# Altium schematic sheet [04]STORAGE.SchDoc
size B
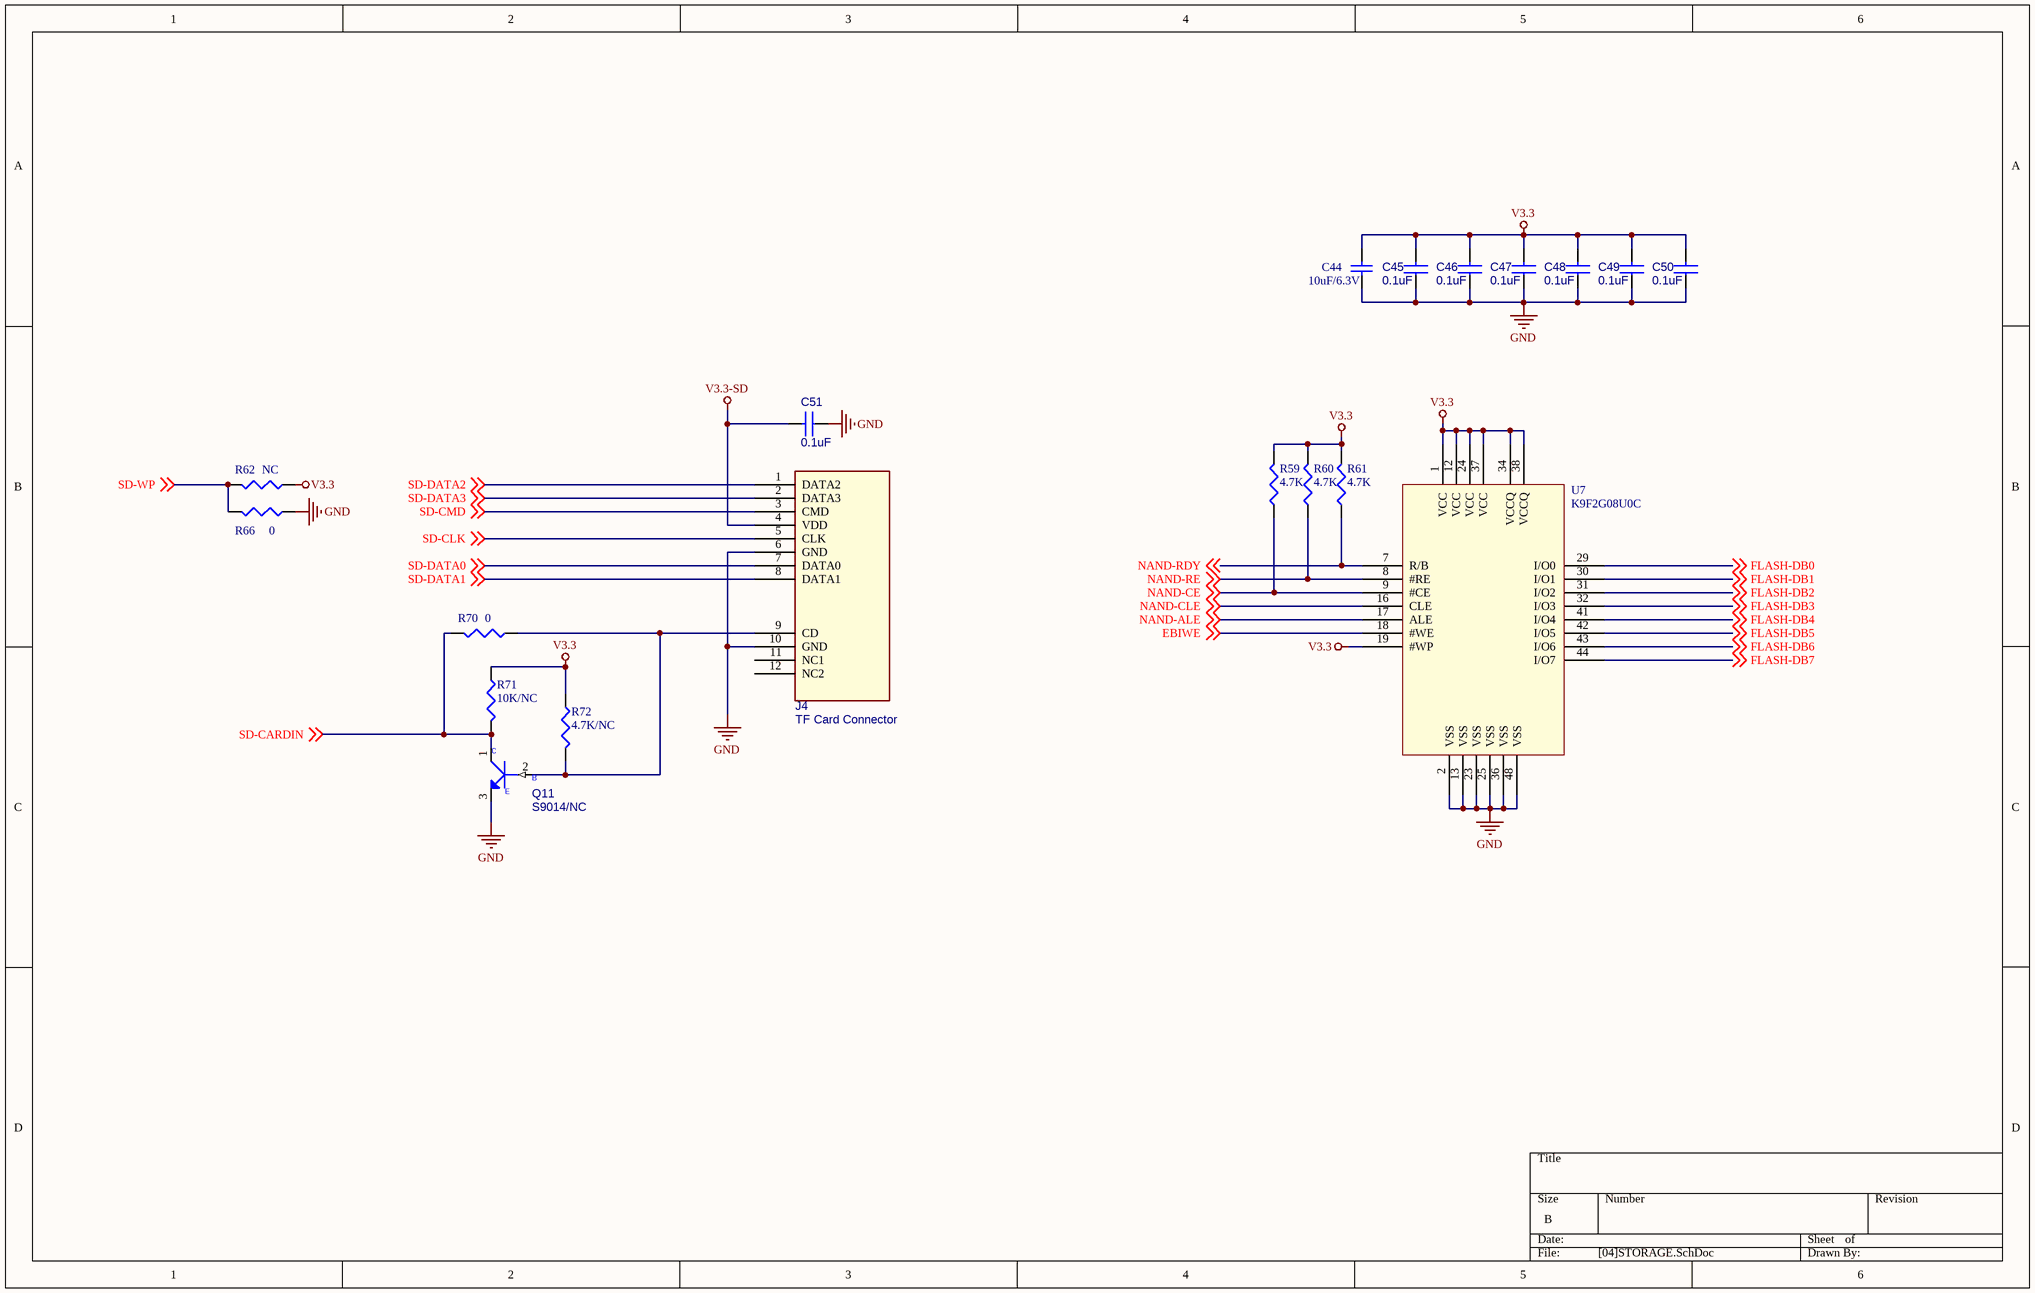
[diagram p0: [04]STORAGE.SchDoc]

## Parts
C44  10uF/6.3V  [0805]
C45  0.1uF  [0603]
C46  0.1uF  [0603]
C47  0.1uF  [0603]
C48  0.1uF  [0603]
C49  0.1uF  [0603]
C50  0.1uF  [0603]
C51  0.1uF  [0603]
J4  TF Card Connector  [TFCARD-2]
Q11  S9014/NC  [NPN]
R59  4.7K  [0603]
R60  4.7K  [0603]
R61  4.7K  [0603]
R62  NC  [0603]
R66  0  [0603]
R70  0  [0603]
R71  10K/NC  [0603]
R72  4.7K/NC  [0603]
U7  K9F2G08U0C  [TSOP48]

## Nets
GND: C44.1 C45.1 C46.1 C47.1 C48.1 C49.1 C50.1 C51.1 J4.6(GND) J4.10(GND) Q11.3(EMITTER) R66.1 U7.2(VSS) U7.13(VSS) U7.23(VSS) U7.25(VSS) U7.36(VSS) U7.48(VSS)
V3.3: C44.2 C45.2 C46.2 C47.2 C48.2 C49.2 C50.2 R59.2 R60.2 R61.2 R62.1 R71.1 R72.1 U7.1(VCC) U7.12(VCC) U7.19(#WP) U7.24(VCC) U7.34(VCCQ) U7.37(VCC) U7.38(VCCQ)
V3.3-SD: C51.2 J4.4(VDD)
EBIWE: U7.18(#WE) ; off-sheet EBIWE
FLASH-DB0: U7.29(I/O0) ; off-sheet FLASH-DB0
FLASH-DB1: U7.30(I/O1) ; off-sheet FLASH-DB1
FLASH-DB2: U7.31(I/O2) ; off-sheet FLASH-DB2
FLASH-DB3: U7.32(I/O3) ; off-sheet FLASH-DB3
FLASH-DB4: U7.41(I/O4) ; off-sheet FLASH-DB4
FLASH-DB5: U7.42(I/O5) ; off-sheet FLASH-DB5
FLASH-DB6: U7.43(I/O6) ; off-sheet FLASH-DB6
FLASH-DB7: U7.44(I/O7) ; off-sheet FLASH-DB7
NAND-ALE: U7.17(ALE) ; off-sheet NAND-ALE
NAND-CE: R59.1 U7.9(#CE) ; off-sheet NAND-CE
NAND-CLE: U7.16(CLE) ; off-sheet NAND-CLE
NAND-RDY: R61.1 U7.7(R/B) ; off-sheet NAND-RDY
NAND-RE: R60.1 U7.8(#RE) ; off-sheet NAND-RE
SD-CARDIN: Q11.1(COLLECTOR) R70.2 R71.2 ; off-sheet SD-CARDIN
SD-CLK: J4.5(CLK) ; off-sheet SD-CLK
SD-CMD: J4.3(CMD) ; off-sheet SD-CMD
SD-DATA0: J4.7(DATA0) ; off-sheet SD-DATA0
SD-DATA1: J4.8(DATA1) ; off-sheet SD-DATA1
SD-DATA2: J4.1(DATA2) ; off-sheet SD-DATA2
SD-DATA3: J4.2(DATA3) ; off-sheet SD-DATA3
SD-WP: R62.2 R66.2 ; off-sheet SD-WP
NetJ4_9: J4.9(CD) Q11.2(BASE) R70.1 R72.2

Not connected (* = marked no-connect by the designer): J4 11(NC1) 12(NC2)

## Notes on the sheet
- (in symbol MMBT3904_NL_SOT23-3) C; B; E

## Library data of the parts
C44 = Cap: Capacitor
C45-C51 = CAP NP_Dup2
J4 = MOLEX_1: CON;HDR,MA,9P,RA,H2.7,SMT
Q11 = MMBT3904_NL_SOT23-3: Part Description: S TR MMBT3904_NL NPN SOT23; Part Number: SB039040000
R59-R62 R66 R70-R72 = Res3: Resistor
U7 = K9GBG08U0A